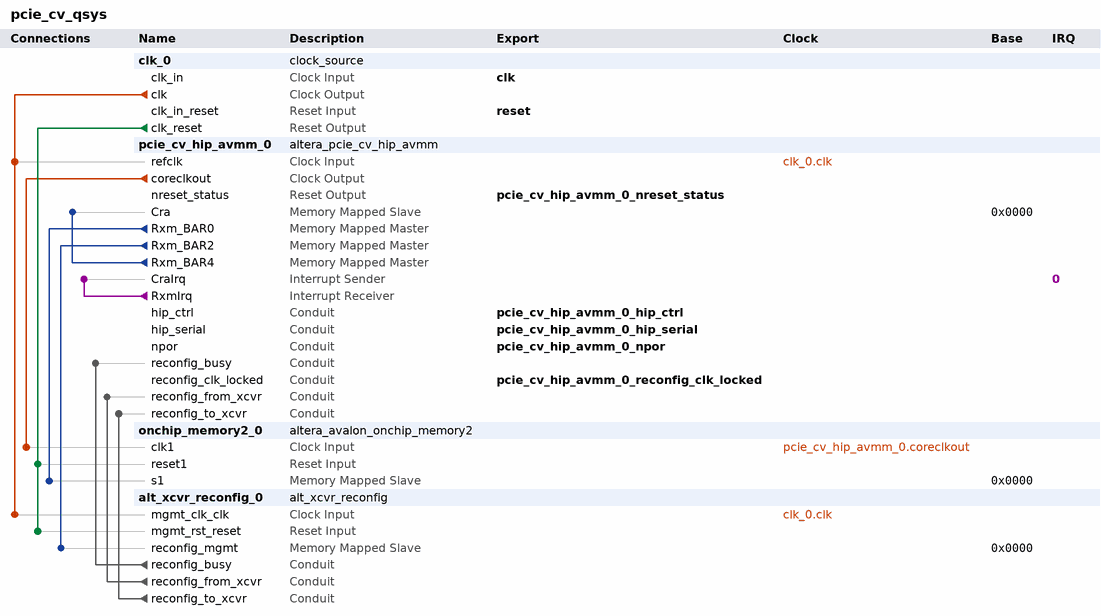
[diagram p0: system contents]
# Platform Designer (Qsys) system pcie_cv_qsys, Cyclone V 5CGXFC7C7F23C8
# Parameters at their usual value, and those the tool derives, are not listed.
package require -exact qsys 17.0
create_system pcie_cv_qsys
set_project_property DEVICE_FAMILY {Cyclone V}
set_project_property DEVICE 5CGXFC7C7F23C8

add_instance clk_0 clock_source 17.0
set_instance_parameter_value clk_0 clockFrequency 100000000

add_instance pcie_cv_hip_avmm_0 altera_pcie_cv_hip_avmm 17.0
set_instance_parameter_value pcie_cv_hip_avmm_0 AST_LITE 0
set_instance_parameter_value pcie_cv_hip_avmm_0 AVALON_ADDR_WIDTH 64
set_instance_parameter_value pcie_cv_hip_avmm_0 AddressPage "0\\,1\\,2\\,3\\,4\\,5\\,6\\,7\\,8\\,9\\,10\\,11\\,12\\,13\\,14\\,15"
set_instance_parameter_value pcie_cv_hip_avmm_0 BYPASSS_A2P_TRANSLATION 0
set_instance_parameter_value pcie_cv_hip_avmm_0 CB_A2P_ADDR_MAP_FIXED_TABLE_0_HIGH 0
set_instance_parameter_value pcie_cv_hip_avmm_0 CB_A2P_ADDR_MAP_FIXED_TABLE_0_LOW 0
set_instance_parameter_value pcie_cv_hip_avmm_0 CB_A2P_ADDR_MAP_FIXED_TABLE_10_HIGH 0
set_instance_parameter_value pcie_cv_hip_avmm_0 CB_A2P_ADDR_MAP_FIXED_TABLE_10_LOW 0
set_instance_parameter_value pcie_cv_hip_avmm_0 CB_A2P_ADDR_MAP_FIXED_TABLE_11_HIGH 0
set_instance_parameter_value pcie_cv_hip_avmm_0 CB_A2P_ADDR_MAP_FIXED_TABLE_11_LOW 0
set_instance_parameter_value pcie_cv_hip_avmm_0 CB_A2P_ADDR_MAP_FIXED_TABLE_12_HIGH 0
set_instance_parameter_value pcie_cv_hip_avmm_0 CB_A2P_ADDR_MAP_FIXED_TABLE_12_LOW 0
set_instance_parameter_value pcie_cv_hip_avmm_0 CB_A2P_ADDR_MAP_FIXED_TABLE_13_HIGH 0
set_instance_parameter_value pcie_cv_hip_avmm_0 CB_A2P_ADDR_MAP_FIXED_TABLE_13_LOW 0
set_instance_parameter_value pcie_cv_hip_avmm_0 CB_A2P_ADDR_MAP_FIXED_TABLE_14_HIGH 0
set_instance_parameter_value pcie_cv_hip_avmm_0 CB_A2P_ADDR_MAP_FIXED_TABLE_14_LOW 0
set_instance_parameter_value pcie_cv_hip_avmm_0 CB_A2P_ADDR_MAP_FIXED_TABLE_15_HIGH 0
set_instance_parameter_value pcie_cv_hip_avmm_0 CB_A2P_ADDR_MAP_FIXED_TABLE_15_LOW 0
set_instance_parameter_value pcie_cv_hip_avmm_0 CB_A2P_ADDR_MAP_FIXED_TABLE_1_HIGH 0
set_instance_parameter_value pcie_cv_hip_avmm_0 CB_A2P_ADDR_MAP_FIXED_TABLE_1_LOW 0
set_instance_parameter_value pcie_cv_hip_avmm_0 CB_A2P_ADDR_MAP_FIXED_TABLE_2_HIGH 0
set_instance_parameter_value pcie_cv_hip_avmm_0 CB_A2P_ADDR_MAP_FIXED_TABLE_2_LOW 0
set_instance_parameter_value pcie_cv_hip_avmm_0 CB_A2P_ADDR_MAP_FIXED_TABLE_3_HIGH 0
set_instance_parameter_value pcie_cv_hip_avmm_0 CB_A2P_ADDR_MAP_FIXED_TABLE_3_LOW 0
set_instance_parameter_value pcie_cv_hip_avmm_0 CB_A2P_ADDR_MAP_FIXED_TABLE_4_HIGH 0
set_instance_parameter_value pcie_cv_hip_avmm_0 CB_A2P_ADDR_MAP_FIXED_TABLE_4_LOW 0
set_instance_parameter_value pcie_cv_hip_avmm_0 CB_A2P_ADDR_MAP_FIXED_TABLE_5_HIGH 0
set_instance_parameter_value pcie_cv_hip_avmm_0 CB_A2P_ADDR_MAP_FIXED_TABLE_5_LOW 0
set_instance_parameter_value pcie_cv_hip_avmm_0 CB_A2P_ADDR_MAP_FIXED_TABLE_6_HIGH 0
set_instance_parameter_value pcie_cv_hip_avmm_0 CB_A2P_ADDR_MAP_FIXED_TABLE_6_LOW 0
set_instance_parameter_value pcie_cv_hip_avmm_0 CB_A2P_ADDR_MAP_FIXED_TABLE_7_HIGH 0
set_instance_parameter_value pcie_cv_hip_avmm_0 CB_A2P_ADDR_MAP_FIXED_TABLE_7_LOW 0
set_instance_parameter_value pcie_cv_hip_avmm_0 CB_A2P_ADDR_MAP_FIXED_TABLE_8_HIGH 0
set_instance_parameter_value pcie_cv_hip_avmm_0 CB_A2P_ADDR_MAP_FIXED_TABLE_8_LOW 0
set_instance_parameter_value pcie_cv_hip_avmm_0 CB_A2P_ADDR_MAP_FIXED_TABLE_9_HIGH 0
set_instance_parameter_value pcie_cv_hip_avmm_0 CB_A2P_ADDR_MAP_FIXED_TABLE_9_LOW 0
set_instance_parameter_value pcie_cv_hip_avmm_0 CB_A2P_ADDR_MAP_IS_FIXED 0
set_instance_parameter_value pcie_cv_hip_avmm_0 CB_A2P_ADDR_MAP_NUM_ENTRIES 2
set_instance_parameter_value pcie_cv_hip_avmm_0 CB_A2P_ADDR_MAP_PASS_THRU_BITS 20
set_instance_parameter_value pcie_cv_hip_avmm_0 CB_P2A_AVALON_ADDR_B0 0x00000000
set_instance_parameter_value pcie_cv_hip_avmm_0 CB_P2A_AVALON_ADDR_B1 0x00000000
set_instance_parameter_value pcie_cv_hip_avmm_0 CB_P2A_AVALON_ADDR_B2 0x00000000
set_instance_parameter_value pcie_cv_hip_avmm_0 CB_P2A_AVALON_ADDR_B3 0x00000000
set_instance_parameter_value pcie_cv_hip_avmm_0 CB_P2A_AVALON_ADDR_B4 0x00000000
set_instance_parameter_value pcie_cv_hip_avmm_0 CB_P2A_AVALON_ADDR_B5 0x00000000
set_instance_parameter_value pcie_cv_hip_avmm_0 CB_P2A_FIXED_AVALON_ADDR_B0 0
set_instance_parameter_value pcie_cv_hip_avmm_0 CB_P2A_FIXED_AVALON_ADDR_B1 0
set_instance_parameter_value pcie_cv_hip_avmm_0 CB_P2A_FIXED_AVALON_ADDR_B2 0
set_instance_parameter_value pcie_cv_hip_avmm_0 CB_P2A_FIXED_AVALON_ADDR_B3 0
set_instance_parameter_value pcie_cv_hip_avmm_0 CB_P2A_FIXED_AVALON_ADDR_B4 0
set_instance_parameter_value pcie_cv_hip_avmm_0 CB_P2A_FIXED_AVALON_ADDR_B5 0
set_instance_parameter_value pcie_cv_hip_avmm_0 CB_PCIE_MODE 0
set_instance_parameter_value pcie_cv_hip_avmm_0 CB_PCIE_RX_LITE 0
set_instance_parameter_value pcie_cv_hip_avmm_0 CB_RP_S_ADDR_WIDTH 32
set_instance_parameter_value pcie_cv_hip_avmm_0 CG_COMMON_CLOCK_MODE 1
set_instance_parameter_value pcie_cv_hip_avmm_0 CG_ENABLE_A2P_INTERRUPT 0
set_instance_parameter_value pcie_cv_hip_avmm_0 CG_ENABLE_ADVANCED_INTERRUPT 0
set_instance_parameter_value pcie_cv_hip_avmm_0 CG_ENABLE_HIP_STATUS 0
set_instance_parameter_value pcie_cv_hip_avmm_0 CG_ENABLE_HIP_STATUS_EXTENSION 0
set_instance_parameter_value pcie_cv_hip_avmm_0 CG_IMPL_CRA_AV_SLAVE_PORT 1
set_instance_parameter_value pcie_cv_hip_avmm_0 CG_RXM_IRQ_NUM 16
set_instance_parameter_value pcie_cv_hip_avmm_0 NUM_PREFETCH_MASTERS 1
set_instance_parameter_value pcie_cv_hip_avmm_0 PCIeAddress31_0 "0x00000000\\,0x00000000\\,0x00000000\\,0x00000000\\,0x00000000\\,0x00000000\\,0x00000000\\,0x00000000\\,0x00000000\\,0x00000000\\,0x00000000\\,0x00000000\\,0x00000000\\,0x00000000\\,0x00000000\\,0x00000000"
set_instance_parameter_value pcie_cv_hip_avmm_0 PCIeAddress63_32 "0x00000000\\,0x00000000\\,0x00000000\\,0x00000000\\,0x00000000\\,0x00000000\\,0x00000000\\,0x00000000\\,0x00000000\\,0x00000000\\,0x00000000\\,0x00000000\\,0x00000000\\,0x00000000\\,0x00000000\\,0x00000000"
set_instance_parameter_value pcie_cv_hip_avmm_0 RXM_BEN_WIDTH 8
set_instance_parameter_value pcie_cv_hip_avmm_0 RXM_DATA_WIDTH 64
set_instance_parameter_value pcie_cv_hip_avmm_0 SLAVE_ADDRESS_MAP_0 12
set_instance_parameter_value pcie_cv_hip_avmm_0 SLAVE_ADDRESS_MAP_1 0
set_instance_parameter_value pcie_cv_hip_avmm_0 SLAVE_ADDRESS_MAP_2 9
set_instance_parameter_value pcie_cv_hip_avmm_0 SLAVE_ADDRESS_MAP_3 0
set_instance_parameter_value pcie_cv_hip_avmm_0 SLAVE_ADDRESS_MAP_4 14
set_instance_parameter_value pcie_cv_hip_avmm_0 SLAVE_ADDRESS_MAP_5 0
set_instance_parameter_value pcie_cv_hip_avmm_0 TX_S_ADDR_WIDTH 32
set_instance_parameter_value pcie_cv_hip_avmm_0 advanced_default_parameter_override 0
set_instance_parameter_value pcie_cv_hip_avmm_0 altpcie_avmm_hwtcl 1
set_instance_parameter_value pcie_cv_hip_avmm_0 atomic_malformed_hwtcl true
set_instance_parameter_value pcie_cv_hip_avmm_0 atomic_op_completer_32bit_hwtcl false
set_instance_parameter_value pcie_cv_hip_avmm_0 atomic_op_completer_64bit_hwtcl false
set_instance_parameter_value pcie_cv_hip_avmm_0 atomic_op_routing_hwtcl false
set_instance_parameter_value pcie_cv_hip_avmm_0 avmm_width_hwtcl 64
set_instance_parameter_value pcie_cv_hip_avmm_0 bar0_type_hwtcl 1
set_instance_parameter_value pcie_cv_hip_avmm_0 bar1_type_hwtcl 0
set_instance_parameter_value pcie_cv_hip_avmm_0 bar2_type_hwtcl 1
set_instance_parameter_value pcie_cv_hip_avmm_0 bar3_type_hwtcl 0
set_instance_parameter_value pcie_cv_hip_avmm_0 bar4_type_hwtcl 1
set_instance_parameter_value pcie_cv_hip_avmm_0 bar5_type_hwtcl 0
set_instance_parameter_value pcie_cv_hip_avmm_0 bridge_port_ssid_support_hwtcl false
set_instance_parameter_value pcie_cv_hip_avmm_0 bridge_port_vga_enable_hwtcl false
set_instance_parameter_value pcie_cv_hip_avmm_0 bypass_cdc_hwtcl false
set_instance_parameter_value pcie_cv_hip_avmm_0 bypass_tl false
set_instance_parameter_value pcie_cv_hip_avmm_0 cas_completer_128bit_hwtcl false
set_instance_parameter_value pcie_cv_hip_avmm_0 cdc_dummy_insert_limit_advanced_default_hwtcl 11
set_instance_parameter_value pcie_cv_hip_avmm_0 class_code_hwtcl 0
set_instance_parameter_value pcie_cv_hip_avmm_0 completion_timeout_hwtcl ABCD
set_instance_parameter_value pcie_cv_hip_avmm_0 coreclkout_hip_phaseshift_hwtcl {0 ps}
set_instance_parameter_value pcie_cv_hip_avmm_0 d0_pme_advanced_default_hwtcl false
set_instance_parameter_value pcie_cv_hip_avmm_0 d1_pme_advanced_default_hwtcl false
set_instance_parameter_value pcie_cv_hip_avmm_0 d1_support_advanced_default_hwtcl false
set_instance_parameter_value pcie_cv_hip_avmm_0 d2_pme_advanced_default_hwtcl false
set_instance_parameter_value pcie_cv_hip_avmm_0 d2_support_advanced_default_hwtcl false
set_instance_parameter_value pcie_cv_hip_avmm_0 d3_cold_pme_advanced_default_hwtcl false
set_instance_parameter_value pcie_cv_hip_avmm_0 d3_hot_pme_advanced_default_hwtcl false
set_instance_parameter_value pcie_cv_hip_avmm_0 data_pack_rx_hwtcl disable
set_instance_parameter_value pcie_cv_hip_avmm_0 deemphasis_enable_advanced_default_hwtcl false
set_instance_parameter_value pcie_cv_hip_avmm_0 deskew_comma_hwtcl skp_eieos_deskw
set_instance_parameter_value pcie_cv_hip_avmm_0 device_id_hwtcl 57353
set_instance_parameter_value pcie_cv_hip_avmm_0 device_number_advanced_default_hwtcl 0
set_instance_parameter_value pcie_cv_hip_avmm_0 diffclock_nfts_count_advanced_default_hwtcl 255
set_instance_parameter_value pcie_cv_hip_avmm_0 disable_link_x2_support_advanced_default_hwtcl false
set_instance_parameter_value pcie_cv_hip_avmm_0 disable_snoop_packet_hwtcl false
set_instance_parameter_value pcie_cv_hip_avmm_0 dll_active_report_support_hwtcl 0
set_instance_parameter_value pcie_cv_hip_avmm_0 ecrc_check_capable_hwtcl 0
set_instance_parameter_value pcie_cv_hip_avmm_0 ecrc_gen_capable_hwtcl 0
set_instance_parameter_value pcie_cv_hip_avmm_0 ei_delay_powerdown_count_advanced_default_hwtcl 10
set_instance_parameter_value pcie_cv_hip_avmm_0 eie_before_nfts_count_advanced_default_hwtcl 4
set_instance_parameter_value pcie_cv_hip_avmm_0 enable_completion_timeout_disable_hwtcl 1
set_instance_parameter_value pcie_cv_hip_avmm_0 enable_function_msix_support_hwtcl 0
set_instance_parameter_value pcie_cv_hip_avmm_0 enable_l0s_aspm_hwtcl true
set_instance_parameter_value pcie_cv_hip_avmm_0 enable_l1_aspm_advanced_default_hwtcl false
set_instance_parameter_value pcie_cv_hip_avmm_0 enable_rx_buffer_checking_advanced_default_hwtcl false
set_instance_parameter_value pcie_cv_hip_avmm_0 enable_slot_register_hwtcl 0
set_instance_parameter_value pcie_cv_hip_avmm_0 endpoint_l0_latency_hwtcl 0
set_instance_parameter_value pcie_cv_hip_avmm_0 endpoint_l1_latency_hwtcl 0
set_instance_parameter_value pcie_cv_hip_avmm_0 expansion_base_address_register_hwtcl 0
set_instance_parameter_value pcie_cv_hip_avmm_0 extend_tag_field_hwtcl 32
set_instance_parameter_value pcie_cv_hip_avmm_0 extended_format_field_hwtcl true
set_instance_parameter_value pcie_cv_hip_avmm_0 extended_tag_reset_hwtcl false
set_instance_parameter_value pcie_cv_hip_avmm_0 fc_init_timer_advanced_default_hwtcl 1024
set_instance_parameter_value pcie_cv_hip_avmm_0 fixed_address_mode 0
set_instance_parameter_value pcie_cv_hip_avmm_0 flow_control_timeout_count_advanced_default_hwtcl 200
set_instance_parameter_value pcie_cv_hip_avmm_0 flow_control_update_count_advanced_default_hwtcl 30
set_instance_parameter_value pcie_cv_hip_avmm_0 flr_capability_hwtcl 0
set_instance_parameter_value pcie_cv_hip_avmm_0 force_hrc 0
set_instance_parameter_value pcie_cv_hip_avmm_0 force_src 0
set_instance_parameter_value pcie_cv_hip_avmm_0 gen123_lane_rate_mode_hwtcl {Gen1 (2.5 Gbps)}
set_instance_parameter_value pcie_cv_hip_avmm_0 gen2_diffclock_nfts_count_advanced_default_hwtcl 255
set_instance_parameter_value pcie_cv_hip_avmm_0 gen2_sameclock_nfts_count_advanced_default_hwtcl 255
set_instance_parameter_value pcie_cv_hip_avmm_0 gen3_rxfreqlock_counter_hwtcl 0
set_instance_parameter_value pcie_cv_hip_avmm_0 hip_reconfig_hwtcl 0
set_instance_parameter_value pcie_cv_hip_avmm_0 hot_plug_support_advanced_default_hwtcl 0
set_instance_parameter_value pcie_cv_hip_avmm_0 in_cvp_mode_hwtcl 0
set_instance_parameter_value pcie_cv_hip_avmm_0 indicator_advanced_default_hwtcl 0
set_instance_parameter_value pcie_cv_hip_avmm_0 interrupt_pin_hwtcl inta
set_instance_parameter_value pcie_cv_hip_avmm_0 io_window_addr_width_hwtcl 0
set_instance_parameter_value pcie_cv_hip_avmm_0 l01_entry_latency_advanced_default_hwtcl 31
set_instance_parameter_value pcie_cv_hip_avmm_0 l0_exit_latency_diffclock_advanced_default_hwtcl 6
set_instance_parameter_value pcie_cv_hip_avmm_0 l0_exit_latency_sameclock_advanced_default_hwtcl 6
set_instance_parameter_value pcie_cv_hip_avmm_0 l1_exit_latency_diffclock_advanced_default_hwtcl 0
set_instance_parameter_value pcie_cv_hip_avmm_0 l1_exit_latency_sameclock_advanced_default_hwtcl 0
set_instance_parameter_value pcie_cv_hip_avmm_0 l2_async_logic_advanced_default_hwtcl disable
set_instance_parameter_value pcie_cv_hip_avmm_0 lane_mask_hwtcl x4
set_instance_parameter_value pcie_cv_hip_avmm_0 low_priority_vc_advanced_default_hwtcl single_vc
set_instance_parameter_value pcie_cv_hip_avmm_0 ltr_mechanism_hwtcl false
set_instance_parameter_value pcie_cv_hip_avmm_0 ltssm_1ms_timeout_hwtcl disable
set_instance_parameter_value pcie_cv_hip_avmm_0 ltssm_freqlocked_check_hwtcl disable
set_instance_parameter_value pcie_cv_hip_avmm_0 max_payload_size_hwtcl 128
set_instance_parameter_value pcie_cv_hip_avmm_0 maximum_current_hwtcl 0
set_instance_parameter_value pcie_cv_hip_avmm_0 msi_64bit_addressing_capable_hwtcl true
set_instance_parameter_value pcie_cv_hip_avmm_0 msi_masking_capable_hwtcl false
set_instance_parameter_value pcie_cv_hip_avmm_0 msi_multi_message_capable_hwtcl 4
set_instance_parameter_value pcie_cv_hip_avmm_0 msi_support_hwtcl true
set_instance_parameter_value pcie_cv_hip_avmm_0 msix_pba_bir_hwtcl 0
set_instance_parameter_value pcie_cv_hip_avmm_0 msix_pba_offset_hwtcl 0
set_instance_parameter_value pcie_cv_hip_avmm_0 msix_table_bir_hwtcl 0
set_instance_parameter_value pcie_cv_hip_avmm_0 msix_table_offset_hwtcl 0
set_instance_parameter_value pcie_cv_hip_avmm_0 msix_table_size_hwtcl 0
set_instance_parameter_value pcie_cv_hip_avmm_0 no_command_completed_advanced_default_hwtcl false
set_instance_parameter_value pcie_cv_hip_avmm_0 no_soft_reset_advanced_default_hwtcl false
set_instance_parameter_value pcie_cv_hip_avmm_0 override_rxbuffer_cred_preset 0
set_instance_parameter_value pcie_cv_hip_avmm_0 override_tbpartner_driver_setting_hwtcl 0
set_instance_parameter_value pcie_cv_hip_avmm_0 pcie_qsys 1
set_instance_parameter_value pcie_cv_hip_avmm_0 pclk_out_sel_advanced_default_hwtcl pclk
set_instance_parameter_value pcie_cv_hip_avmm_0 pipex1_debug_sel_advanced_default_hwtcl disable
set_instance_parameter_value pcie_cv_hip_avmm_0 pldclk_hip_phase_shift_hwtcl {0 ps}
set_instance_parameter_value pcie_cv_hip_avmm_0 pll_refclk_freq_hwtcl {100 MHz}
set_instance_parameter_value pcie_cv_hip_avmm_0 port_link_number_hwtcl 1
set_instance_parameter_value pcie_cv_hip_avmm_0 port_type_hwtcl {Native endpoint}
set_instance_parameter_value pcie_cv_hip_avmm_0 prefetchable_mem_window_addr_width_hwtcl 0
set_instance_parameter_value pcie_cv_hip_avmm_0 register_pipe_signals_advanced_default_hwtcl true
set_instance_parameter_value pcie_cv_hip_avmm_0 reserved_debug_advanced_default_hwtcl 0
set_instance_parameter_value pcie_cv_hip_avmm_0 retry_buffer_last_active_address_advanced_default_hwtcl 255
set_instance_parameter_value pcie_cv_hip_avmm_0 revision_id_hwtcl 1
set_instance_parameter_value pcie_cv_hip_avmm_0 rpre_emph_a_val_hwtcl 11
set_instance_parameter_value pcie_cv_hip_avmm_0 rpre_emph_b_val_hwtcl 0
set_instance_parameter_value pcie_cv_hip_avmm_0 rpre_emph_c_val_hwtcl 22
set_instance_parameter_value pcie_cv_hip_avmm_0 rpre_emph_d_val_hwtcl 12
set_instance_parameter_value pcie_cv_hip_avmm_0 rpre_emph_e_val_hwtcl 21
set_instance_parameter_value pcie_cv_hip_avmm_0 rvod_sel_a_val_hwtcl 50
set_instance_parameter_value pcie_cv_hip_avmm_0 rvod_sel_b_val_hwtcl 34
set_instance_parameter_value pcie_cv_hip_avmm_0 rvod_sel_c_val_hwtcl 50
set_instance_parameter_value pcie_cv_hip_avmm_0 rvod_sel_d_val_hwtcl 50
set_instance_parameter_value pcie_cv_hip_avmm_0 rvod_sel_e_val_hwtcl 9
set_instance_parameter_value pcie_cv_hip_avmm_0 rx_cdc_almost_full_advanced_default_hwtcl 12
set_instance_parameter_value pcie_cv_hip_avmm_0 rx_l0s_count_idl_advanced_default_hwtcl 0
set_instance_parameter_value pcie_cv_hip_avmm_0 rxbuffer_rxreq_hwtcl Low
set_instance_parameter_value pcie_cv_hip_avmm_0 sameclock_nfts_count_advanced_default_hwtcl 255
set_instance_parameter_value pcie_cv_hip_avmm_0 serial_sim_hwtcl 0
set_instance_parameter_value pcie_cv_hip_avmm_0 set_pld_clk_x1_625MHz_hwtcl 0
set_instance_parameter_value pcie_cv_hip_avmm_0 skp_os_gen3_count_hwtcl 0
set_instance_parameter_value pcie_cv_hip_avmm_0 skp_os_schedule_count_advanced_default_hwtcl 0
set_instance_parameter_value pcie_cv_hip_avmm_0 slot_number_hwtcl 0
set_instance_parameter_value pcie_cv_hip_avmm_0 slot_power_limit_hwtcl 0
set_instance_parameter_value pcie_cv_hip_avmm_0 slot_power_scale_hwtcl 0
set_instance_parameter_value pcie_cv_hip_avmm_0 slotclkcfg_hwtcl 1
set_instance_parameter_value pcie_cv_hip_avmm_0 ssid_hwtcl 0
set_instance_parameter_value pcie_cv_hip_avmm_0 ssvid_hwtcl 0
set_instance_parameter_value pcie_cv_hip_avmm_0 subsystem_device_id_hwtcl 0
set_instance_parameter_value pcie_cv_hip_avmm_0 subsystem_vendor_id_hwtcl 0
set_instance_parameter_value pcie_cv_hip_avmm_0 surprise_down_error_support_hwtcl 0
set_instance_parameter_value pcie_cv_hip_avmm_0 tph_completer_hwtcl false
set_instance_parameter_value pcie_cv_hip_avmm_0 tx_cdc_almost_empty_advanced_default_hwtcl 5
set_instance_parameter_value pcie_cv_hip_avmm_0 tx_cdc_almost_full_advanced_default_hwtcl 11
set_instance_parameter_value pcie_cv_hip_avmm_0 use_aer_hwtcl 0
set_instance_parameter_value pcie_cv_hip_avmm_0 use_ast_parity 0
set_instance_parameter_value pcie_cv_hip_avmm_0 use_crc_forwarding_hwtcl 0
set_instance_parameter_value pcie_cv_hip_avmm_0 use_rx_st_be_hwtcl 0
set_instance_parameter_value pcie_cv_hip_avmm_0 use_tl_cfg_sync_advanced_default_hwtcl 1
set_instance_parameter_value pcie_cv_hip_avmm_0 user_id_hwtcl 0
set_instance_parameter_value pcie_cv_hip_avmm_0 vc0_clk_enable_advanced_default_hwtcl true
set_instance_parameter_value pcie_cv_hip_avmm_0 vendor_id_hwtcl 4466
set_instance_parameter_value pcie_cv_hip_avmm_0 vsec_id_hwtcl 4466
set_instance_parameter_value pcie_cv_hip_avmm_0 vsec_rev_hwtcl 0
set_instance_parameter_value pcie_cv_hip_avmm_0 wrong_device_id_hwtcl disable

add_instance onchip_memory2_0 altera_avalon_onchip_memory2 17.0
set_instance_parameter_value onchip_memory2_0 dataWidth 32
set_instance_parameter_value onchip_memory2_0 dualPort false
set_instance_parameter_value onchip_memory2_0 initMemContent true
set_instance_parameter_value onchip_memory2_0 initializationFileName onchip_mem.hex
set_instance_parameter_value onchip_memory2_0 memorySize 4096

add_instance alt_xcvr_reconfig_0 alt_xcvr_reconfig 17.0
set_instance_parameter_value alt_xcvr_reconfig_0 device_family {Cyclone V}
set_instance_parameter_value alt_xcvr_reconfig_0 enable_adce 0
set_instance_parameter_value alt_xcvr_reconfig_0 enable_analog 0
set_instance_parameter_value alt_xcvr_reconfig_0 number_of_reconfig_interfaces 5

# connections
add_connection clk_0.clk alt_xcvr_reconfig_0.mgmt_clk_clk clock
add_connection clk_0.clk pcie_cv_hip_avmm_0.refclk clock
add_connection pcie_cv_hip_avmm_0.coreclkout onchip_memory2_0.clk1 clock
add_connection clk_0.clk_reset alt_xcvr_reconfig_0.mgmt_rst_reset reset
add_connection clk_0.clk_reset onchip_memory2_0.reset1 reset
add_connection pcie_cv_hip_avmm_0.Rxm_BAR0 onchip_memory2_0.s1 avalon
set_connection_parameter_value pcie_cv_hip_avmm_0.Rxm_BAR0/onchip_memory2_0.s1 baseAddress 0x0000
add_connection pcie_cv_hip_avmm_0.Rxm_BAR2 alt_xcvr_reconfig_0.reconfig_mgmt avalon
set_connection_parameter_value pcie_cv_hip_avmm_0.Rxm_BAR2/alt_xcvr_reconfig_0.reconfig_mgmt baseAddress 0x0000
add_connection pcie_cv_hip_avmm_0.Rxm_BAR4 pcie_cv_hip_avmm_0.Cra avalon
set_connection_parameter_value pcie_cv_hip_avmm_0.Rxm_BAR4/pcie_cv_hip_avmm_0.Cra baseAddress 0x0000
add_connection alt_xcvr_reconfig_0.reconfig_busy pcie_cv_hip_avmm_0.reconfig_busy conduit
add_connection alt_xcvr_reconfig_0.reconfig_from_xcvr pcie_cv_hip_avmm_0.reconfig_from_xcvr conduit
add_connection alt_xcvr_reconfig_0.reconfig_to_xcvr pcie_cv_hip_avmm_0.reconfig_to_xcvr conduit
add_connection pcie_cv_hip_avmm_0.RxmIrq pcie_cv_hip_avmm_0.CraIrq interrupt
set_connection_parameter_value pcie_cv_hip_avmm_0.RxmIrq/pcie_cv_hip_avmm_0.CraIrq irqNumber 0

# exported interfaces
add_interface clk clock sink
set_interface_property clk EXPORT_OF clk_0.clk_in
add_interface pcie_cv_hip_avmm_0_hip_ctrl conduit end
set_interface_property pcie_cv_hip_avmm_0_hip_ctrl EXPORT_OF pcie_cv_hip_avmm_0.hip_ctrl
add_interface pcie_cv_hip_avmm_0_hip_serial conduit end
set_interface_property pcie_cv_hip_avmm_0_hip_serial EXPORT_OF pcie_cv_hip_avmm_0.hip_serial
add_interface pcie_cv_hip_avmm_0_npor conduit end
set_interface_property pcie_cv_hip_avmm_0_npor EXPORT_OF pcie_cv_hip_avmm_0.npor
add_interface pcie_cv_hip_avmm_0_nreset_status reset source
set_interface_property pcie_cv_hip_avmm_0_nreset_status EXPORT_OF pcie_cv_hip_avmm_0.nreset_status
add_interface pcie_cv_hip_avmm_0_reconfig_clk_locked conduit end
set_interface_property pcie_cv_hip_avmm_0_reconfig_clk_locked EXPORT_OF pcie_cv_hip_avmm_0.reconfig_clk_locked
add_interface reset reset sink
set_interface_property reset EXPORT_OF clk_0.clk_in_reset

set_interconnect_requirement {$system} qsys_mm.clockCrossingAdapter HANDSHAKE
set_interconnect_requirement {$system} qsys_mm.enableEccProtection FALSE
set_interconnect_requirement {$system} qsys_mm.insertDefaultSlave FALSE
set_interconnect_requirement {$system} qsys_mm.maxAdditionalLatency 1

save_system pcie_cv_qsys.qsys
